# EAGLE schematic base (EAGLE 9.6.1)
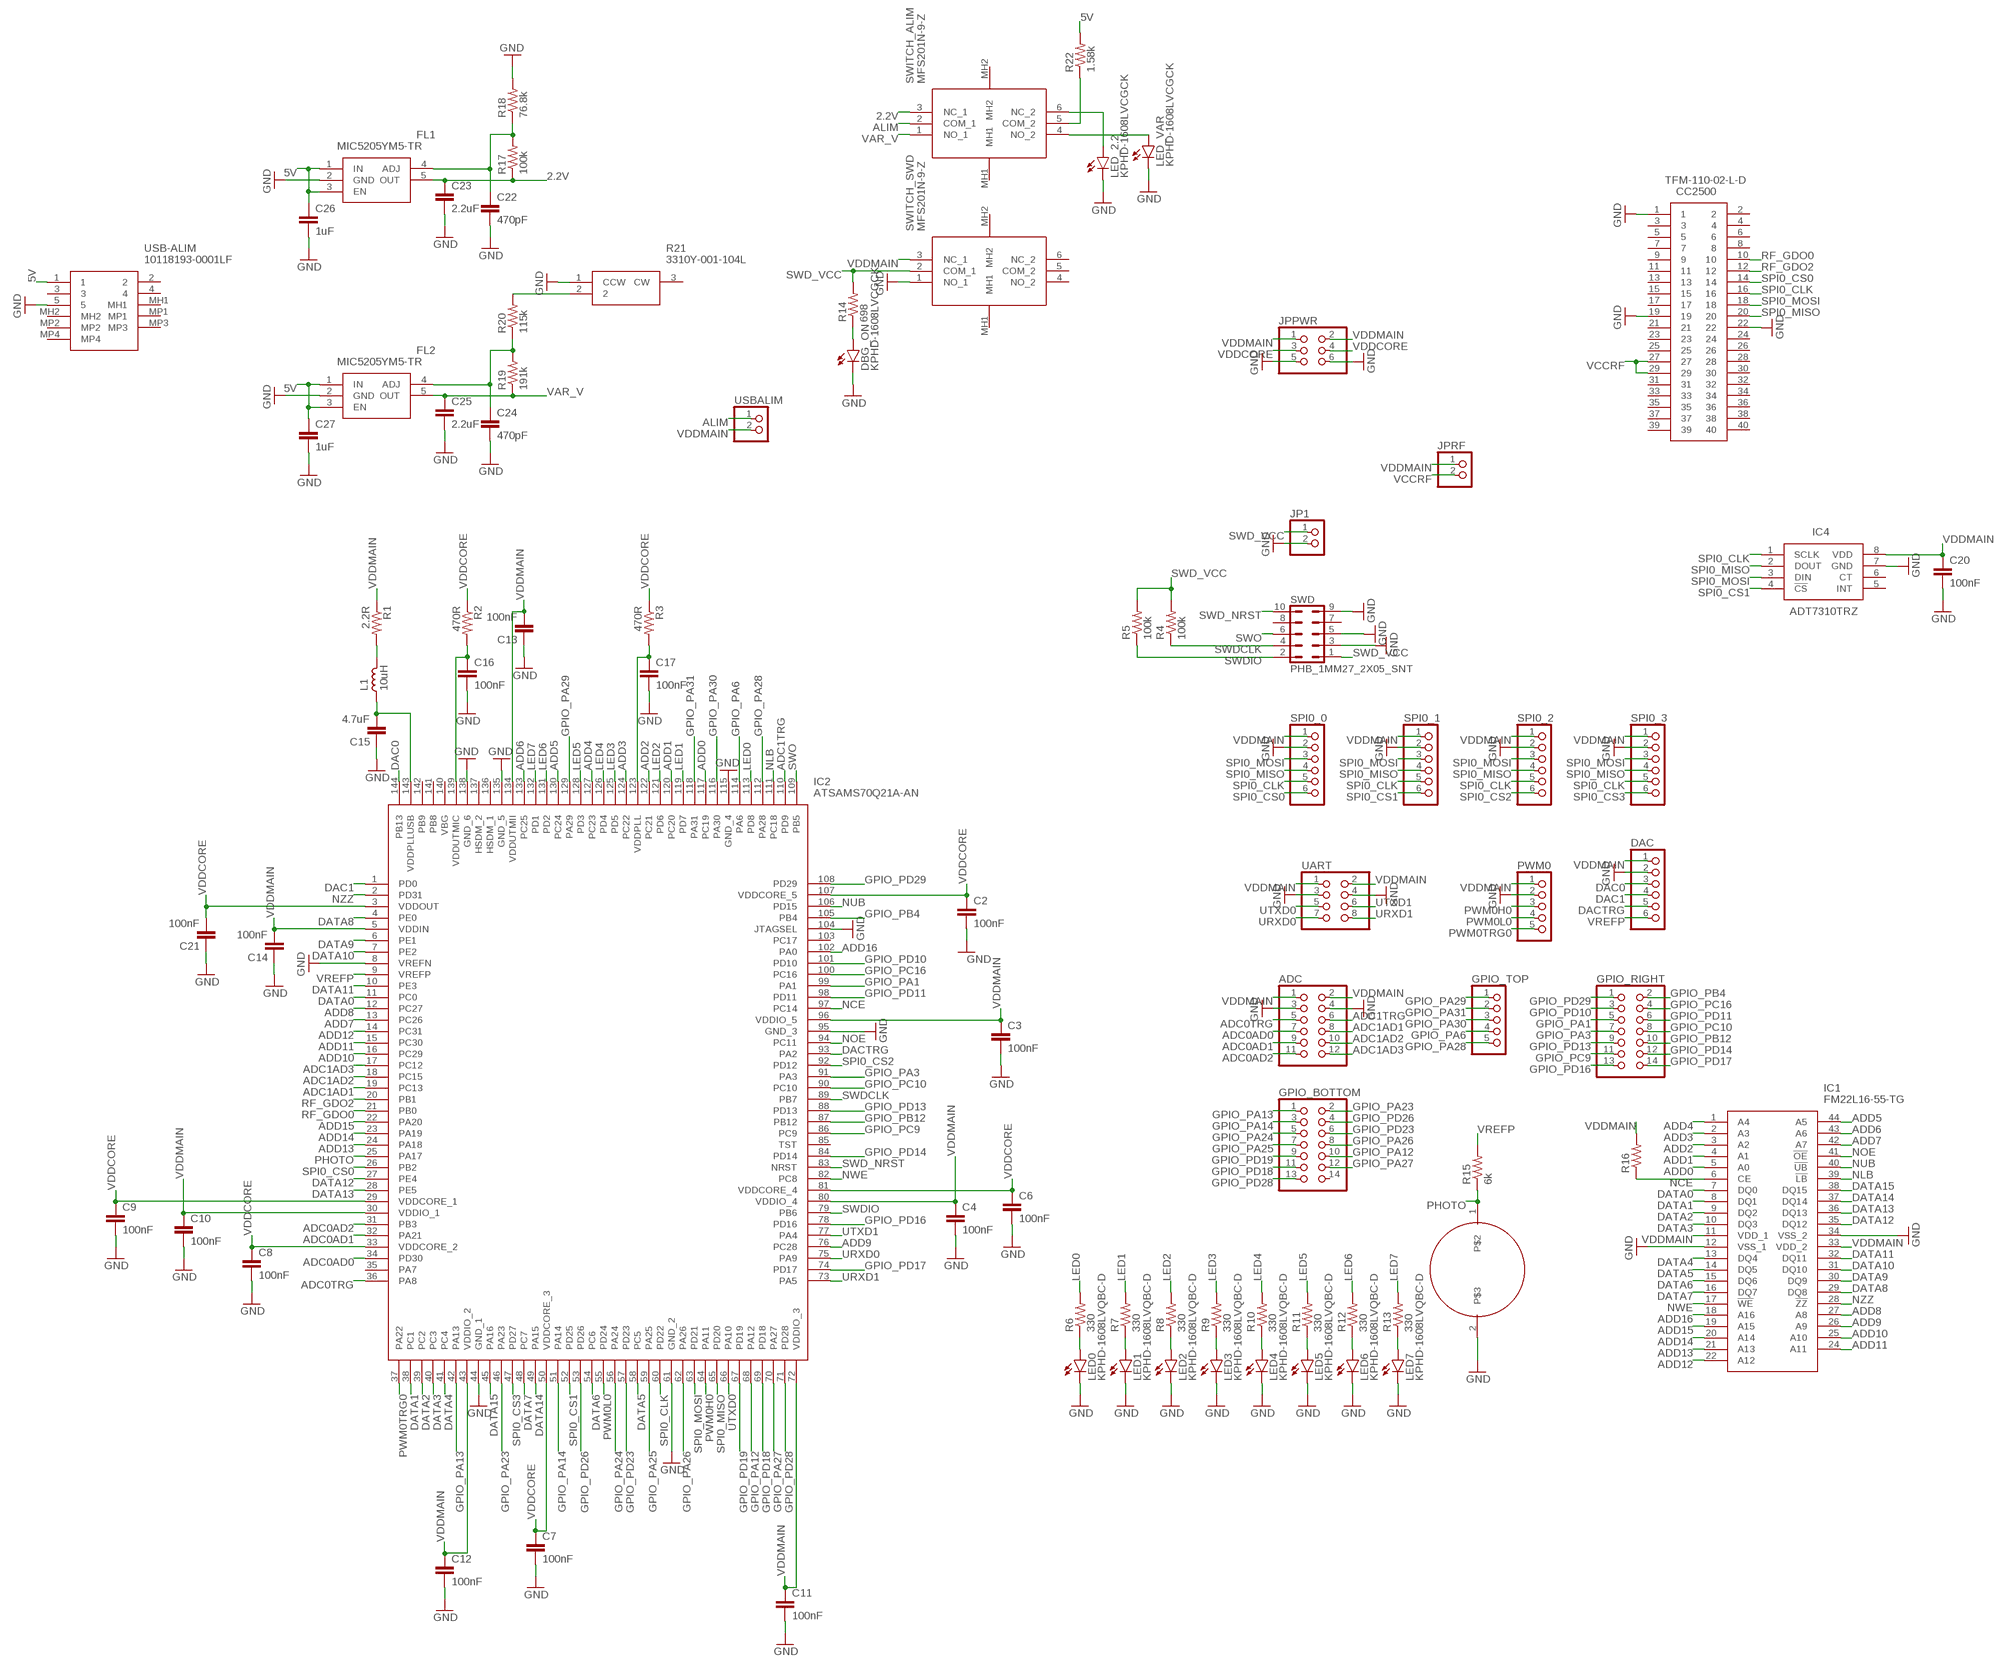
[diagram p0: schematic, sheet 1]

## Parts
ADC  PINHD-2X6  [2X06]
C2  100nF  C-EUC0603  [C0603]
C3  100nF  C-EUC0603  [C0603]
C4  100nF  C-EUC0603  [C0603]
C6  100nF  C-EUC0603  [C0603]
C7  100nF  C-EUC0603  [C0603]
C8  100nF  C-EUC0603  [C0603]
C9  100nF  C-EUC0603  [C0603]
C10  100nF  C-EUC0603  [C0603]
C11  100nF  C-EUC0603  [C0603]
C12  100nF  C-EUC0603  [C0603]
C13  100nF  C-EUC0603  [C0603]
C14  100nF  C-EUC0603  [C0603]
C15  4.7uF  C-EUC0603  [C0603]
C16  100nF  C-EUC0603  [C0603]
C17  100nF  C-EUC0603  [C0603]
C20  100nF  C-EUC0603  [C0603]
C21  100nF  C-EUC0603  [C0603]
C22  470pF  C-EUC0603  [C0603]
C23  2.2uF  C-EUC0603  [C0603]
C24  470pF  C-EUC0603  [C0603]
C25  2.2uF  C-EUC0603  [C0603]
C26  1uF  C-EUC0603  [C0603]
C27  1uF  C-EUC0603  [C0603]
CC2500  TFM-110-02-L-D  [TFM-110-02-L]
DAC  PINHD-1X6  [1X06]
DBG_ON  KPHD-1608LVCGCK  LEDCHIP-LED0603  [CHIP-LED0603]
FL1  MIC5205YM5-TR  [SOT95P280X145-5N]
FL2  MIC5205YM5-TR  [SOT95P280X145-5N]
GPIO_BOTTOM  PINHD-2X7  [2X07]
GPIO_RIGHT  PINHD-2X7  [2X07]
GPIO_TOP  PINHD-1X5  [1X05]
IC1  FM22L16-55-TG  [SOP80P1184X119-44N]
IC2  ATSAMS70Q21A-AN  [QFP50P2200X2200X160-144N]
IC4  ADT7310TRZ  [SOIC127P600X175-8N]
JP1  PINHD-1X2  [1X02]
JPPWR  PINHD-2X3  [2X03]
JPRF  PINHD-1X2  [1X02]
L1  10uH  L_0603  [L0603]
LED0  KPHD-1608LVQBC-D  LEDCHIP-LED0603  [CHIP-LED0603]
LED1  KPHD-1608LVQBC-D  LEDCHIP-LED0603  [CHIP-LED0603]
LED2  KPHD-1608LVQBC-D  LEDCHIP-LED0603  [CHIP-LED0603]
LED3  KPHD-1608LVQBC-D  LEDCHIP-LED0603  [CHIP-LED0603]
LED4  KPHD-1608LVQBC-D  LEDCHIP-LED0603  [CHIP-LED0603]
LED5  KPHD-1608LVQBC-D  LEDCHIP-LED0603  [CHIP-LED0603]
LED6  KPHD-1608LVQBC-D  LEDCHIP-LED0603  [CHIP-LED0603]
LED7  KPHD-1608LVQBC-D  LEDCHIP-LED0603  [CHIP-LED0603]
LED_2.2  KPHD-1608LVCGCK  LEDCHIP-LED0603  [CHIP-LED0603]
LED_VAR  KPHD-1608LVCGCK  LEDCHIP-LED0603  [CHIP-LED0603]
PWM0  PINHD-1X5  [1X05]
R1  2.2R  R-US_R0603  [R0603]
R2  470R  R-US_R0603  [R0603]
R3  470R  R-US_R0603  [R0603]
R4  100k  R-US_R0603  [R0603]
R5  100k  R-US_R0603  [R0603]
R6  330  R-US_R0603  [R0603]
R7  330  R-US_R0603  [R0603]
R8  330  R-US_R0603  [R0603]
R9  330  R-US_R0603  [R0603]
R10  330  R-US_R0603  [R0603]
R11  330  R-US_R0603  [R0603]
R12  330  R-US_R0603  [R0603]
R13  330  R-US_R0603  [R0603]
R14  698  R-US_R0603  [R0603]
R15  6k  R-US_R0603  [R0603]
R16  R-US_R0603  [R0603]
R17  100k  R-US_R0603  [R0603]
R18  76.8k  R-US_R0603  [R0603]
R19  191k  R-US_R0603  [R0603]
R20  115k  R-US_R0603  [R0603]
R21  3310Y-001-104L  [3310Y-001]
R22  1.58k  R-US_R0603  [R0603]
SPI0_0  PINHD-1X6  [1X06]
SPI0_1  PINHD-1X6  [1X06]
SPI0_2  PINHD-1X6  [1X06]
SPI0_3  PINHD-1X6  [1X06]
SWD  PHB_1MM27_2X05_SNT  [PHB_1MM27_2X05_SNT]
SWITCH_ALIM  MFS201N-9-Z  [MFS201N9Z]
SWITCH_SWD  MFS201N-9-Z  [MFS201N9Z]
U$1  NSL-4962  [TO-8]
UART  PINHD-2X4  [2X04]
USB-ALIM  10118193-0001LF  [101181930001LF]
USBALIM  PINHD-1X2  [1X02]

## Nets
2.2V: C23.1 FL1.5(OUT) R17.1 SWITCH_ALIM.3(NC_1)
5V: C26.1 C27.1 FL1.1(IN) FL1.3(EN) FL2.1(IN) FL2.3(EN) R22.2 USB-ALIM.1
ADC0AD0: ADC.7 IC2.34(PD30)
ADC0AD1: ADC.9 IC2.32(PA21)
ADC0AD2: ADC.11 IC2.31(PB3)
ADC0TRG: ADC.5 IC2.36(PA8)
ADC1AD1: ADC.8 IC2.19(PC13)
ADC1AD2: ADC.10 IC2.18(PC15)
ADC1AD3: ADC.12 IC2.17(PC12)
ADC1TRG: ADC.6 IC2.110(PD9)
ADD0: IC1.5(A0) IC2.117(PC19)
ADD1: IC1.4(A1) IC2.120(PC20)
ADD2: IC1.3(A2) IC2.122(PC21)
ADD3: IC1.2(A3) IC2.124(PC22)
ADD4: IC1.1(A4) IC2.127(PC23)
ADD5: IC1.44(A5) IC2.130(PC24)
ADD6: IC1.43(A6) IC2.133(PC25)
ADD7: IC1.42(A7) IC2.13(PC26)
ADD8: IC1.27(A8) IC2.12(PC27)
ADD9: IC1.26(A9) IC2.76(PC28)
ADD10: IC1.25(A10) IC2.16(PC29)
ADD11: IC1.24(A11) IC2.15(PC30)
ADD12: IC1.22(A12) IC2.14(PC31)
ADD13: IC1.21(A13) IC2.24(PA18)
ADD14: IC1.20(A14) IC2.23(PA19)
ADD15: IC1.19(A15) IC2.22(PA20)
ADD16: IC1.18(A16) IC2.102(PA0)
ALIM: SWITCH_ALIM.2(COM_1) USBALIM.1
DAC0: DAC.3 IC2.144(PB13)
DAC1: DAC.4 IC2.1(PD0)
DACTRG: DAC.5 IC2.93(PA2)
DATA0: IC1.7(DQ0) IC2.11(PC0)
DATA1: IC1.8(DQ1) IC2.38(PC1)
DATA2: IC1.9(DQ2) IC2.39(PC2)
DATA3: IC1.10(DQ3) IC2.40(PC3)
DATA4: IC1.13(DQ4) IC2.41(PC4)
DATA5: IC1.14(DQ5) IC2.58(PC5)
DATA6: IC1.15(DQ6) IC2.54(PC6)
DATA7: IC1.16(DQ7) IC2.48(PC7)
DATA8: IC1.29(DQ8) IC2.4(PE0)
DATA9: IC1.30(DQ9) IC2.6(PE1)
DATA10: IC1.31(DQ10) IC2.7(PE2)
DATA11: IC1.32(DQ11) IC2.10(PE3)
DATA12: IC1.35(DQ12) IC2.27(PE4)
DATA13: IC1.36(DQ13) IC2.28(PE5)
DATA14: IC1.37(DQ14) IC2.49(PA15)
DATA15: IC1.38(DQ15) IC2.45(PA16)
GND: ADC.3 ADC.4 C2.2 C3.2 C4.2 C6.2 C7.2 C8.2 C9.2 C10.2 C11.2 C12.2 C13.1 C14.1 C15.1 C16.2 C17.2 C20.2 C21.1 C22.2 C23.2 C24.2 C25.2 C26.2 C27.2 CC2500.1 CC2500.19 CC2500.22 DAC.2 DBG_ON.C FL1.2(GND) FL2.2(GND) IC1.12(VSS_1) IC1.34(VSS_2) IC2.8(VREFN) IC2.44(GND_1) IC2.61(GND_2) IC2.95(GND_3) IC2.104(JTAGSEL) IC2.115(GND_4) IC2.135(GND_5) IC2.138(GND_6) IC4.7(GND) JP1.2 JPPWR.5 JPPWR.6 LED0.C LED1.C LED2.C LED3.C LED4.C LED5.C LED6.C LED7.C LED_2.2.C LED_VAR.C PWM0.2 R18.2 R21.1(CCW) SPI0_0.2 SPI0_1.2 SPI0_2.2 SPI0_3.2 SWD.3 SWD.5 SWD.9 SWITCH_SWD.1(NO_1) U$1.2 UART.3 UART.4 USB-ALIM.5
GPIO_PA1: GPIO_RIGHT.5 IC2.99(PA1)
GPIO_PA3: GPIO_RIGHT.7 IC2.91(PA3)
GPIO_PA6: GPIO_TOP.4 IC2.114(PA6)
GPIO_PA12: GPIO_BOTTOM.10 IC2.68(PA12)
GPIO_PA13: GPIO_BOTTOM.1 IC2.42(PA13)
GPIO_PA14: GPIO_BOTTOM.3 IC2.51(PA14)
GPIO_PA23: GPIO_BOTTOM.2 IC2.46(PA23)
GPIO_PA24: GPIO_BOTTOM.5 IC2.56(PA24)
GPIO_PA25: GPIO_BOTTOM.7 IC2.59(PA25)
GPIO_PA26: GPIO_BOTTOM.8 IC2.62(PA26)
GPIO_PA27: GPIO_BOTTOM.12 IC2.70(PA27)
GPIO_PA28: GPIO_TOP.5 IC2.112(PA28)
GPIO_PA29: GPIO_TOP.1 IC2.129(PA29)
GPIO_PA30: GPIO_TOP.3 IC2.116(PA30)
GPIO_PA31: GPIO_TOP.2 IC2.118(PA31)
GPIO_PB4: GPIO_RIGHT.2 IC2.105(PB4)
GPIO_PB12: GPIO_RIGHT.10 IC2.87(PB12)
GPIO_PC9: GPIO_RIGHT.11 IC2.86(PC9)
GPIO_PC10: GPIO_RIGHT.8 IC2.90(PC10)
GPIO_PC16: GPIO_RIGHT.4 IC2.100(PC16)
GPIO_PD10: GPIO_RIGHT.3 IC2.101(PD10)
GPIO_PD11: GPIO_RIGHT.6 IC2.98(PD11)
GPIO_PD13: GPIO_RIGHT.9 IC2.88(PD13)
GPIO_PD14: GPIO_RIGHT.12 IC2.84(PD14)
GPIO_PD16: GPIO_RIGHT.13 IC2.78(PD16)
GPIO_PD17: GPIO_RIGHT.14 IC2.74(PD17)
GPIO_PD18: GPIO_BOTTOM.11 IC2.69(PD18)
GPIO_PD19: GPIO_BOTTOM.9 IC2.67(PD19)
GPIO_PD23: GPIO_BOTTOM.6 IC2.57(PD23)
GPIO_PD26: GPIO_BOTTOM.4 IC2.53(PD26)
GPIO_PD28: GPIO_BOTTOM.13 IC2.71(PD28)
GPIO_PD29: GPIO_RIGHT.1 IC2.108(PD29)
LED0: IC2.113(PD8) R6.2
LED1: IC2.119(PD7) R7.2
LED2: IC2.121(PD6) R8.2
LED3: IC2.125(PD5) R9.2
LED4: IC2.126(PD4) R10.2
LED5: IC2.128(PD3) R11.2
LED6: IC2.131(PD2) R12.2
LED7: IC2.132(PD1) R13.2
N$1: C15.2 IC2.143(VDDPLLUSB) L1.2
N$2: L1.1 R1.2
N$3: C16.1 IC2.139(VDDUTMIC) R2.2
N$4: C17.1 IC2.123(VDDPLL) R3.2
N$5: LED0.A R6.1
N$6: LED1.A R7.1
N$7: LED2.A R8.1
N$8: LED3.A R9.1
N$9: LED4.A R10.1
N$10: LED5.A R11.1
N$11: LED6.A R12.1
N$12: LED7.A R13.1
N$13: DBG_ON.A R14.1
N$14: C24.1 FL2.4(ADJ) R19.2 R20.1
N$15: C22.1 FL1.4(ADJ) R17.2 R18.1
N$16: R20.2 R21.2
N$17: LED_2.2.A SWITCH_ALIM.6(NC_2)
N$18: R22.1 SWITCH_ALIM.5(COM_2)
N$19: LED_VAR.A SWITCH_ALIM.4(NO_2)
NCE: IC1.6(CE) IC2.97(PC14) R16.1
NLB: IC1.39(!LB) IC2.111(PC18)
NOE: IC1.41(!OE) IC2.94(PC11)
NUB: IC1.40(!UB) IC2.106(PD15)
NWE: IC1.17(!WE) IC2.82(PC8)
NZZ: IC1.28(!ZZ) IC2.2(PD31)
PHOTO: IC2.25(PA17) R15.1 U$1.1
PWM0H0: IC2.64(PA11) PWM0.3
PWM0L0: IC2.55(PD24) PWM0.4
PWM0TRG0: IC2.37(PA22) PWM0.5
RF_GDO0: CC2500.10 IC2.21(PB0)
RF_GDO2: CC2500.12 IC2.20(PB1)
SPI0_CLK: CC2500.16 IC2.60(PD22) IC4.1(SCLK) SPI0_0.5 SPI0_1.5 SPI0_2.5 SPI0_3.5
SPI0_CS0: CC2500.14 IC2.26(PB2) SPI0_0.6
SPI0_CS1: IC2.52(PD25) IC4.4(!CS) SPI0_1.6
SPI0_CS2: IC2.92(PD12) SPI0_2.6
SPI0_CS3: IC2.47(PD27) SPI0_3.6
SPI0_MISO: CC2500.20 IC2.65(PD20) IC4.2(DOUT) SPI0_0.4 SPI0_1.4 SPI0_2.4 SPI0_3.4
SPI0_MOSI: CC2500.18 IC2.63(PD21) IC4.3(DIN) SPI0_0.3 SPI0_1.3 SPI0_2.3 SPI0_3.3
SWD_NRST: IC2.83(NRST) SWD.10
SWD_VCC: JP1.1 R4.2 R5.2 R14.2 SWD.1 SWITCH_SWD.2(COM_1)
SWDCLK: IC2.89(PB7) R4.1 SWD.4
SWDIO: IC2.79(PB6) R5.1 SWD.2
SWO: IC2.109(PB5) SWD.6
URXD0: IC2.75(PA9) UART.7
URXD1: IC2.73(PA5) UART.8
UTXD0: IC2.66(PA10) UART.5
UTXD1: IC2.77(PA4) UART.6
VAR_V: C25.1 FL2.5(OUT) R19.1 SWITCH_ALIM.1(NO_1)
VCCRF: CC2500.27 CC2500.29 JPRF.2
VDDCORE: C2.1 C6.1 C7.1 C8.1 C9.1 C21.2 IC2.3(VDDOUT) IC2.29(VDDCORE_1) IC2.33(VDDCORE_2) IC2.50(VDDCORE_3) IC2.81(VDDCORE_4) IC2.107(VDDCORE_5) JPPWR.3 JPPWR.4 R2.1 R3.1
VDDMAIN: ADC.1 ADC.2 C3.1 C4.1 C10.1 C11.1 C12.1 C13.2 C14.2 C20.1 DAC.1 IC1.11(VDD_1) IC1.33(VDD_2) IC2.5(VDDIN) IC2.30(VDDIO_1) IC2.43(VDDIO_2) IC2.72(VDDIO_3) IC2.80(VDDIO_4) IC2.96(VDDIO_5) IC2.134(VDDUTMII) IC4.8(VDD) JPPWR.1 JPPWR.2 JPRF.1 PWM0.1 R1.1 R16.2 SPI0_0.1 SPI0_1.1 SPI0_2.1 SPI0_3.1 SWITCH_SWD.3(NC_1) UART.1 UART.2 USBALIM.2
VREFP: DAC.6 IC2.9(VREFP) R15.2
Unconnected: CC2500.2 CC2500.3 CC2500.4 CC2500.5 CC2500.6 CC2500.7 CC2500.8 CC2500.9 CC2500.11 CC2500.13 CC2500.15 CC2500.17 CC2500.21 CC2500.23 CC2500.24 CC2500.25 CC2500.26 CC2500.28 CC2500.30 CC2500.31 CC2500.32 CC2500.33 CC2500.34 CC2500.35 CC2500.36 CC2500.37 CC2500.38 CC2500.39 CC2500.40 GPIO_BOTTOM.14 IC2.35(PA7) IC2.85(TST) IC2.103(PC17) IC2.136(HSDM_1) IC2.137(HSDM_2) IC2.140(VBG) IC2.141(PB8) IC2.142(PB9) IC4.5(INT) IC4.6(CT) R21.3(CW) SWD.7 SWD.8 SWITCH_ALIM.MH1 SWITCH_ALIM.MH2 SWITCH_SWD.4(NO_2) SWITCH_SWD.5(COM_2) SWITCH_SWD.6(NC_2) SWITCH_SWD.MH1 SWITCH_SWD.MH2 USB-ALIM.2 USB-ALIM.3 USB-ALIM.4 USB-ALIM.MH1 USB-ALIM.MH2 USB-ALIM.MP1 USB-ALIM.MP2 USB-ALIM.MP3 USB-ALIM.MP4

## Library data of the parts
ADC = pinhead:PINHD-2X6: PIN HEADER
C2-C4 C6-C17 C20-C27 = rcl:C-EU: CAPACITOR, European symbol; SPICEPREFIX: C
CC2500 = TFM-110-02-L-D:TFM-110-02-L-D: Samtec TFM Series, 1.27mm Pitch 20 Way 2 Row Straight PCB Header, Solder Termination, 5A Source: Datasheet <http://suddendocs.samtec.com/prints/tfm-1xx-xx-xxx-d-xxx-mkt.pdf>; DESCRIPTION: Samtec TFM Series, 1.27mm Pitch 20 Way 2 Row Straight PCB Header, Solder Termination, 5A; HEIGHT: mm; MANUFACTURER_NAME: SAMTEC; MANUFACTURER_PART_NUMBER: TFM-110-02-L-D; MOUSER_PART_NUMBER: 200-TFM11002LD; MOUSER_PRICE-STOCK: https://www.mouser.com/Search/Refine.aspx?Keyword=200-TFM11002LD; RS_PART_NUMBER: 7655947; RS_PRICE-STOCK: https://uk.rs-online.com/web/p/products/7655947
DAC SPI0_0 SPI0_1-SPI0_3 = pinhead:PINHD-1X6: PIN HEADER
DBG_ON LED0 LED1-LED7 LED_2.2 LED_VAR = led:LED: LED OSRAM: - CHIPLED LG R971, LG N971, LY N971, LG Q971, LY Q971, LO R971, LY R971 LH N974, LH R974 LS Q976, LO Q976, LY Q976 LO Q996 - Hyper CHIPLED LW Q18S LB Q993, LB Q99A, LB R99A - SideLED LS A670, LO A670, LY A670, LG A670, LP A670 LB A673, LV A673, LT A673, LW A673 LH A674 LY A675 LS A676, LA A676, LO A676, LY A676, LW A676 LS A679, LY A679, LG A679 - Hyper Micro SIDELED® LS Y876, LA Y876, LO Y876, LY Y876 LT Y87S - SmartLED LW L88C, LW L88S LB L89C, LB L89S, LG L890 LS L89K, LO L89K, LY L89K LS L896, LA L896, LO L896, LY L896 - TOPLED LS T670, LO T670, LY T670, LG T670, LP T670 LSG T670, LSP T670, LSY T670, LOP T670, LYG T670 LG T671, LOG T671, LSG T671 LB T673, LV T673, LT T673, LW T673 LH T674 LS T676, LA T676, LO T676, LY T676, LB T676, LH T676, LSB T676, LW T676 LB T67C, LV T67C, LT T67C, LS T67K, LO T67K, LY T67K, LW E67C LS E67B, LA E67B, LO E67B, LY E67B, LB E67C, LV E67C, LT E67C LW T67C LS T679, LY T679, LG T679 LS T770, LO T770, LY T770, LG T770, LP T770 LB T773, LV T773, LT T773, LW T773 LH T774 LS E675, LA E675, LY E675, LS T675 LS T776, LA T776, LO T776, LY T776, LB T776 LHGB T686 LT T68C, LB T68C - Hyper Mini TOPLED® LB M676 - Mini TOPLED Santana® LG M470 LS M47K, LO M47K, LY M47K Source: http://www.osram.convergy.de LUXEON: - LUMILED® LXK2-PW12-R00, LXK2-PW12-S00, LXK2-PW14-U00, LXK2-PW14-V00 LXK2-PM12-R00, LXK2-PM12-S00, LXK2-PM14-U00 LXK2-PE12-Q00, LXK2-PE12-R00, LXK2-PE12-S00, LXK2-PE14-T00, LXK2-PE14-U00 LXK2-PB12-K00, LXK2-PB12-L00, LXK2-PB12-M00, LXK2-PB14-N00, LXK2-PB14-P00, LXK2-PB14-Q00 LXK2-PR12-L00, LXK2-PR12-M00, LXK2-PR14-Q00, LXK2-PR14-R00 LXK2-PD12-Q00, LXK2-PD12-R00, LXK2-PD12-S00 LXK2-PH12-R00, LXK2-PH12-S00 LXK2-PL12-P00, LXK2-PL12-Q00, LXK2-PL12-R00 Source: www.luxeon.com KINGBRIGHT: KA-3528ASYC Source: www.kingbright.com
FL1 FL2 = MIC5205YM5-TR:MIC5205YM5-TR: Microchip MIC5205YM5-TR, LDO Regulator, 150mA Adjustable, 1%, 2.5 16 Vin 5-Pin, SOT-23 Source: Datasheet <https://componentsearchengine.com/Datasheets/2/MIC5205YM5-TR.pdf>; DESCRIPTION: Microchip MIC5205YM5-TR, LDO Regulator, 150mA Adjustable, 1%, 2.5 16 Vin 5-Pin, SOT-23; HEIGHT: 1.45mm; MANUFACTURER_NAME: Microchip; MANUFACTURER_PART_NUMBER: MIC5205YM5-TR; MOUSER_PART_NUMBER: 998-MIC5205YM5TR; MOUSER_PRICE-STOCK: https://www.mouser.com/Search/Refine.aspx?Keyword=998-MIC5205YM5TR; RS_PART_NUMBER: 9101449P; RS_PRICE-STOCK: http://uk.rs-online.com/web/p/products/9101449P
GPIO_BOTTOM GPIO_RIGHT = pinhead:PINHD-2X7: PIN HEADER
GPIO_TOP PWM0 = pinhead:PINHD-1X5: PIN HEADER
IC1 = FM28V202A-TG:FM22L16-55-TG: FM22L16-55-TG Parallel FRAM Memory, 4Mbit, 55ns, 2.7 3.6 V 44-Pin TSOP Source: Datasheet <http://uk.rs-online.com/web/p/products/0394831>; DESCRIPTION: FM22L16-55-TG Parallel FRAM Memory, 4Mbit, 55ns, 2.7 3.6 V 44-Pin TSOP; HEIGHT: 1.194mm; MANUFACTURER_NAME: Cypress Semiconductor; MANUFACTURER_PART_NUMBER: FM22L16-55-TG; MOUSER_PART_NUMBER: 877-FM22L16-55-TG; MOUSER_PRICE-STOCK: https://www.mouser.com/Search/Refine.aspx?Keyword=877-FM22L16-55-TG; RS_PART_NUMBER: 1254206P; RS_PRICE-STOCK: http://uk.rs-online.com/web/p/products/1254206P
IC2 = ATSAMS70Q21A-AN:ATSAMS70Q21A-AN: MICROCHIP - ATSAMS70Q21A-AN - MCU, 32BIT, CORTEX-M7, 300MHZ, LQFP-144 Source: Datasheet <https://componentsearchengine.com/Datasheets/2/ATSAMS70Q21A-AN.pdf>; DESCRIPTION: MICROCHIP - ATSAMS70Q21A-AN - MCU, 32BIT, CORTEX-M7, 300MHZ, LQFP-144; HEIGHT: 1.6mm; MANUFACTURER_NAME: Microchip; MANUFACTURER_PART_NUMBER: ATSAMS70Q21A-AN; MOUSER_PART_NUMBER: 556-ATSAMS70Q21A-AN; MOUSER_PRICE-STOCK: https://www.mouser.com/Search/Refine.aspx?Keyword=556-ATSAMS70Q21A-AN; RS_PART_NUMBER: 1773760P; RS_PRICE-STOCK: http://uk.rs-online.com/web/p/products/1773760P
IC4 = ADT7310TRZ:ADT7310TRZ: ADT7310TRZ, 16 bit Temperature Sensor +/-0.5C Serial-SPI 2.7 3.6 V 8-Pin SOIC Source: Datasheet <http://docs-emea.rs-online.com/webdocs/12a1/0900766b812a177b.pdf>; DESCRIPTION: ADT7310TRZ, 16 bit Temperature Sensor +/-0.5C Serial-SPI 2.7 3.6 V 8-Pin SOIC; HEIGHT: 1.75mm; MANUFACTURER_NAME: Analog Devices; MANUFACTURER_PART_NUMBER: ADT7310TRZ; MOUSER_PART_NUMBER: 584-ADT7310TRZ; MOUSER_PRICE-STOCK: https://www.mouser.com/Search/Refine.aspx?Keyword=584-ADT7310TRZ; RS_PART_NUMBER: 7969022P; RS_PRICE-STOCK: http://uk.rs-online.com/web/p/products/7969022P
JP1 JPRF USBALIM = pinhead:PINHD-1X2: PIN HEADER
JPPWR = pinhead:PINHD-2X3: PIN HEADER
L1 = rc-master-smd:L_: INDUCTOR
R1-R20 R22 = rcl:R-US_: RESISTOR, American symbol; SPICEPREFIX: R
R21 = 3310Y-001-104L:3310Y-001-104L: Bourns Conductive Plastic Potentiometer 3310Y Series with a 3.17 mm Dia. Shaft 100k +/-20% 0.25W +/-1000ppm/C, Linear Source: Datasheet <http://www.bourns.com/docs/Product-Datasheets/3310.pdf>; DESCRIPTION: Bourns Conductive Plastic Potentiometer 3310Y Series with a 3.17 mm Dia. Shaft 100k +/-20% 0.25W +/-1000ppm/C, Linear; HEIGHT: mm; MANUFACTURER_NAME: Bourns; MANUFACTURER_PART_NUMBER: 3310Y-001-104L; MOUSER_PART_NUMBER: 652-3310Y-001-104L; MOUSER_PRICE-STOCK: https://www.mouser.com/Search/Refine.aspx?Keyword=652-3310Y-001-104L; RS_PART_NUMBER: 2508317400; RS_PRICE-STOCK: http://uk.rs-online.com/web/p/products/2508317400
SWD = _hhn_con_pinhead_box_1mm27:PHB_1MM27_2X05_*: Pin Header Box-Type, 1.27mm/0.5"/50mil Pitch, 2x05 Circuits Note: see library description for an important note about THT-version
SWITCH_ALIM SWITCH_SWD = MFS201N-9-Z:MFS201N-9-Z: SLIDE SWITCH, DPDT, 1A, 125VAC, TH; Contact Configuration:DPDT; Switch Operation:On-On; Switch Mounting:Through Hole; Product Range:MFS Series; Contact Current Max:1A; Contact Voltage AC Max:125V; Contact Voltage DC Max:30V RoHS Compliant: Yes Source: Datasheet <https://www.nidec-copal-electronics.com/e/catalog/switch/mfs.pdf>; ARROW_PART_NUMBER: MFS201N-9-Z; DESCRIPTION: SLIDE SWITCH, DPDT, 1A, 125VAC, TH; Contact Configuration:DPDT; Switch Operation:On-On; Switch Mounting:Through Hole; Product Range:MFS Series; Contact Current Max:1A; Contact Voltage AC Max:125V; Contact Voltage DC Max:30V RoHS Compliant: Yes; HEIGHT: 14mm; MANUFACTURER_NAME: Copal Electronics; MANUFACTURER_PART_NUMBER: MFS201N-9-Z
U$1 = NSL-4962:NSL-4962
UART = pinhead:PINHD-2X4: PIN HEADER
USB-ALIM = 10118193-0001LF:10118193-0001LF: USB Connectors 5P MICRO USB TYPE B RECEPTACLE W/ PEGS Source: Datasheet <https://componentsearchengine.com/Datasheets/1/10118193-0001LF.pdf>; ALLIED_NUMBER: 70236827; ALLIED_PRICE-STOCK: https://www.alliedelec.com/amphenolicc-10118193-0001lf/70236827/; DESCRIPTION: USB Connectors 5P MICRO USB TYPE B RECEPTACLE W/ PEGS; HEIGHT: 3.1mm; MANUFACTURER_NAME: Amphenol; MANUFACTURER_PART_NUMBER: 10118193-0001LF; MOUSER_PART_NUMBER: 649-10118193-0001LF; MOUSER_PRICE-STOCK: https://www.mouser.com/Search/Refine.aspx?Keyword=649-10118193-0001LF; RS_PART_NUMBER: 8632989; RS_PRICE-STOCK: http://uk.rs-online.com/web/p/products/8632989